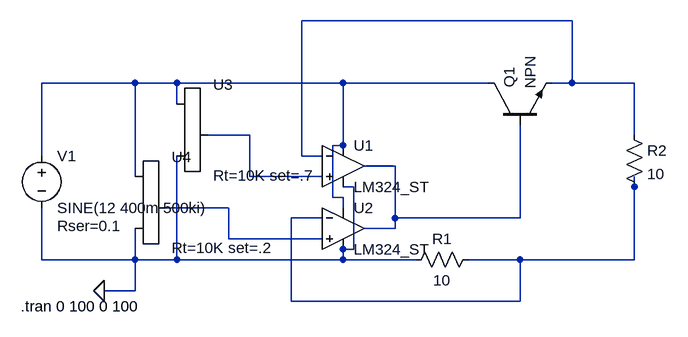
[diagram p0: schematic rev 1.3.asc]
rev 1.3.asc, the LTspice schematic file:
Version 4
SHEET 1 880 680
WIRE 560 -64 144 -64
WIRE -112 32 -256 32
WIRE -48 32 -112 32
WIRE 208 32 -48 32
WIRE 432 32 208 32
WIRE 560 32 560 -64
WIRE 560 32 528 32
WIRE 656 32 560 32
WIRE -48 64 -48 32
WIRE 64 112 0 112
WIRE 656 112 656 32
WIRE 208 128 208 32
WIRE 208 128 192 128
WIRE -256 144 -256 32
WIRE 144 144 144 -64
WIRE 176 144 144 144
WIRE 288 160 240 160
WIRE -112 176 -112 32
WIRE 64 176 64 112
WIRE 176 176 64 176
WIRE 224 192 208 192
WIRE 656 192 656 176
WIRE 192 208 192 128
WIRE 208 208 192 208
WIRE 32 224 -64 224
WIRE 208 224 208 208
WIRE 176 240 128 240
WIRE 288 240 288 160
WIRE 480 240 480 96
WIRE 480 240 288 240
WIRE 288 256 288 240
WIRE 288 256 240 256
WIRE 32 272 32 224
WIRE 176 272 32 272
WIRE 224 288 224 192
WIRE 224 288 208 288
WIRE -256 304 -256 224
WIRE -112 304 -112 256
WIRE -112 304 -256 304
WIRE -48 304 -48 144
WIRE -48 304 -112 304
WIRE 208 304 208 288
WIRE 208 304 -48 304
WIRE 320 304 208 304
WIRE 480 304 400 304
WIRE 656 304 656 192
WIRE 656 304 480 304
WIRE -112 352 -112 304
WIRE -112 352 -160 352
WIRE 128 368 128 240
WIRE 480 368 480 304
WIRE 480 368 128 368
FLAG -160 352 0
SYMBOL EXTRA\\ExtraOpamps\\LM324_ST 208 160 R0
SYMATTR InstName U1
SYMBOL EXTRA\\ExtraOpamps\\LM324_ST 208 256 R0
SYMATTR InstName U2
SYMBOL Pot&Sw\\potentiometer_standard -64 48 R0
SYMATTR InstName U3
SYMATTR Value Rt=10K set=.7
SYMATTR SpiceLine Rtap=100 tap=0.5
SYMBOL Pot&Sw\\potentiometer_standard -128 160 R0
SYMATTR InstName U4
SYMATTR Value Rt=10K set=.2
SYMATTR SpiceLine Rtap=10 tap=0.5
SYMBOL npn 432 96 R270
WINDOW 3 55 64 Left 2
SYMATTR InstName Q1
SYMBOL voltage -256 128 R0
WINDOW 123 0 0 Left 0
WINDOW 39 24 124 Left 2
SYMATTR SpiceLine Rser=0.1
SYMATTR InstName V1
SYMATTR Value SINE(12 400m 500ki)
SYMBOL res 416 288 R90
WINDOW 0 0 56 VBottom 2
WINDOW 3 32 56 VTop 2
SYMATTR InstName R1
SYMATTR Value 10
SYMATTR SpiceLine tol=1 pwr=0.1
SYMBOL res 640 96 R0
SYMATTR InstName R2
SYMATTR Value 10
SYMATTR SpiceLine tol=1 pwr=0.1
TEXT -288 376 Left 2 !.tran 0 100 0 100

The netlist it stands for:
* rev 1.3.asc
* U1: LM324_ST (symbol EXTRA\ExtraOpamps\LM324_ST not available, pins judged from their places): In+=N003 In-=N001 V+=N002 V-=0 OUT=N004
* U2: LM324_ST (symbol EXTRA\ExtraOpamps\LM324_ST not available, pins judged from their places): In+=N006 In-=N005 V+=N002 V-=0 OUT=N004
XU3 N002 0 N003 Rt=10K set=.7 Rtap=100 tap=0.5
XU4 N002 0 N006 Rt=10K set=.2 Rtap=10 tap=0.5
Q1 N002 N004 N001 0 NPN
V1 N002 0 SINE(12 400m 500ki) Rser=0.1
R1 N005 0 10 tol=1 pwr=0.1
R2 N001 N005 10 tol=1 pwr=0.1
.model NPN NPN
.model PNP PNP
.lib standard.bjt
.tran 0 100 0 100
.backanno
.end